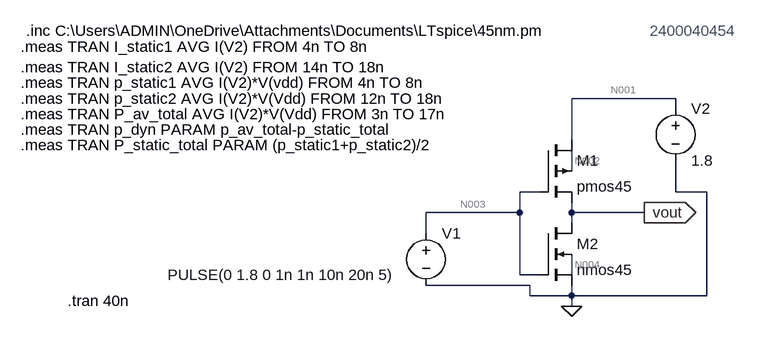
[diagram p0: schematic Ex6.asc]
Ex6.asc, the LTspice schematic file:
Version 4.1
SHEET 1 880 680
WIRE 368 -32 208 -32
WIRE 368 -16 368 -32
WIRE 208 32 208 -32
WIRE 208 80 208 48
WIRE 160 112 128 112
WIRE 368 112 368 64
WIRE 416 112 368 112
WIRE 128 144 128 112
WIRE 128 144 -16 144
WIRE 208 144 208 128
WIRE 320 144 208 144
WIRE 208 160 208 144
WIRE -16 176 -16 144
WIRE 128 240 128 144
WIRE 160 240 128 240
WIRE 208 240 208 208
WIRE 144 256 -16 256
WIRE 144 272 144 256
WIRE 208 272 208 256
WIRE 208 272 144 272
WIRE 416 272 416 112
WIRE 416 272 208 272
WIRE 208 288 208 272
FLAG 320 144 vout
IOPIN 320 144 Out
FLAG 208 288 0
SYMBOL pmos4 160 32 R0
SYMATTR InstName M1
SYMATTR Value pmos45
SYMATTR Value2 l=45n w=1u
SYMBOL nmos4 160 160 R0
SYMATTR InstName M2
SYMATTR Value nmos45
SYMATTR Value2 l=45n w=1u
SYMBOL voltage -16 160 R0
WINDOW 3 -398 80 Left 2
WINDOW 123 0 0 Left 0
WINDOW 39 0 0 Left 0
SYMATTR Value PULSE(0 1.8 0 1n 1n 10n 20n 5)
SYMATTR InstName V1
SYMBOL voltage 368 -32 R0
WINDOW 123 0 0 Left 0
WINDOW 39 0 0 Left 0
SYMATTR InstName V2
SYMATTR Value 1.8
TEXT -640 -112 Left 2 !.meas TRAN I_static1 AVG I(V2) FROM 4n TO 8n
TEXT -640 -80 Left 2 !.meas TRAN I_static2 AVG I(V2) FROM 14n TO 18n
TEXT -568 280 Left 2 !.tran 40n
TEXT -632 -136 Left 2 !.inc C:\\Users\\ADMIN\\OneDrive\\Attachments\\Documents\\LTspice\\45nm.pm
TEXT -640 -56 Left 2 !.meas TRAN p_static1 AVG I(V2)*V(vdd) FROM 4n TO 8n
TEXT -640 -32 Left 2 !.meas TRAN p_static2 AVG I(V2)*V(Vdd) FROM 12n TO 18n
TEXT -640 -8 Left 2 !.meas TRAN P_av_total AVG I(V2)*V(Vdd) FROM 3n TO 17n
TEXT -640 16 Left 2 !.meas TRAN p_dyn PARAM p_av_total-p_static_total
TEXT -640 40 Left 2 !.meas TRAN P_static_total PARAM (p_static1+p_static2)/2
TEXT 328 -136 Left 2 ;2400040454

The netlist it stands for:
* Ex6.asc
M1 N001 N003 vout N002 pmos45 l=45n w=1u
M2 vout N003 0 N004 nmos45 l=45n w=1u
V1 N003 0 PULSE(0 1.8 0 1n 1n 10n 20n 5)
V2 N001 0 1.8
.model NMOS NMOS
.model PMOS PMOS
.lib standard.mos
.meas TRAN I_static1 AVG I(V2) FROM 4n TO 8n
.meas TRAN I_static2 AVG I(V2) FROM 14n TO 18n
.tran 40n
.inc C:\Users\ADMIN\OneDrive\Attachments\Documents\LTspice\45nm.pm
.meas TRAN p_static1 AVG I(V2)*V(vdd) FROM 4n TO 8n
.meas TRAN p_static2 AVG I(V2)*V(Vdd) FROM 12n TO 18n
.meas TRAN P_av_total AVG I(V2)*V(Vdd) FROM 3n TO 17n
.meas TRAN p_dyn PARAM p_av_total-p_static_total
.meas TRAN P_static_total PARAM (p_static1+p_static2)/2
* 2400040454
.backanno
.end

* Results of the author's LTspice run, read from the files saved beside the schematic
* Operating Point, zero values left out:
*   V(n001) = 1.8 V
*   V(n002) = 1.467 V
*   V(n004) = 571.9 mV
*   V(vout) = 1.8 V
*   I(V1) = 4.634 nA
*   I(V2) = -461.2 nA
*   Ib(M1) = -1.474 pA
*   Id(M1) = 461.2 nA
*   Id(M2) = 456.6 nA
*   Ig(M1) = -4.634 nA
*   Is(M1) = -456.6 nA
*   Is(M2) = -456.6 nA
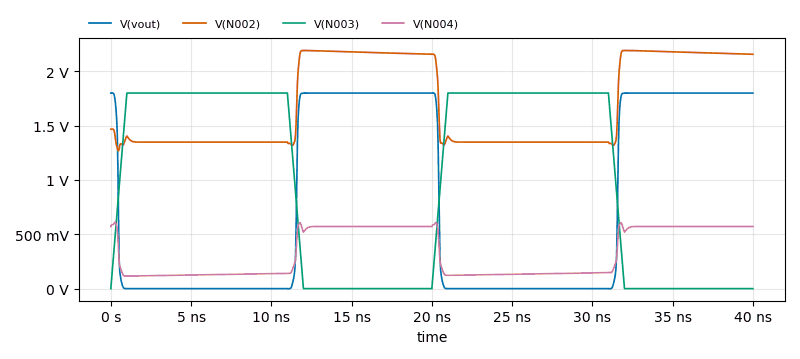
[diagram p1: Transient Analysis of Ex6.asc, plotted from the saved traces]
* Transient Analysis, 1 run:
*   V(vout): min -1.554 mV, max 1.803 V, average 798.6 mV, rms 1.192 V, last 1.8 V
*   V(N002): min 1.267 V, max 2.193 V, average 1.704 V, rms 1.751 V, last 2.157 V
*   V(N003): min 0 V, max 1.8 V, average 990 mV, rms 1.315 V, last 0 V
*   V(N004): min 115.5 mV, max 612 mV, average 329.2 mV, rms 394.3 mV, last 571.9 mV